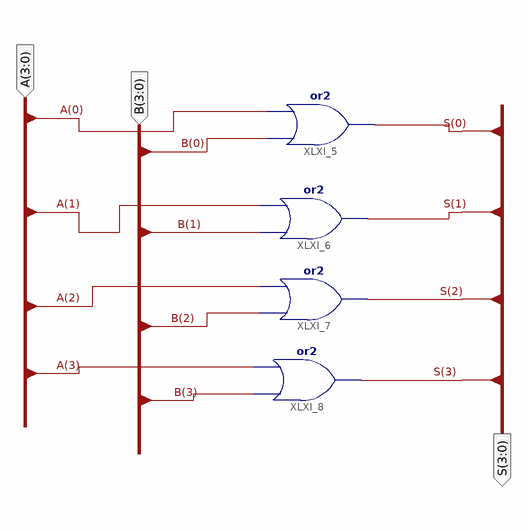
[diagram p0: schematic sheet 1]
// Xilinx ISE schematic MyOr2b4.sch (kintex7) as structural Verilog: 4 symbols, 3 ports
module MyOr2b4 (
  input  [3:0] A,
  input  [3:0] B,
  output [3:0] S
);

  or XLXI_5 (S[0], B[0], A[0]);
  or XLXI_6 (S[1], B[1], A[1]);
  or XLXI_7 (S[2], B[2], A[2]);
  or XLXI_8 (S[3], B[3], A[3]);
endmodule
